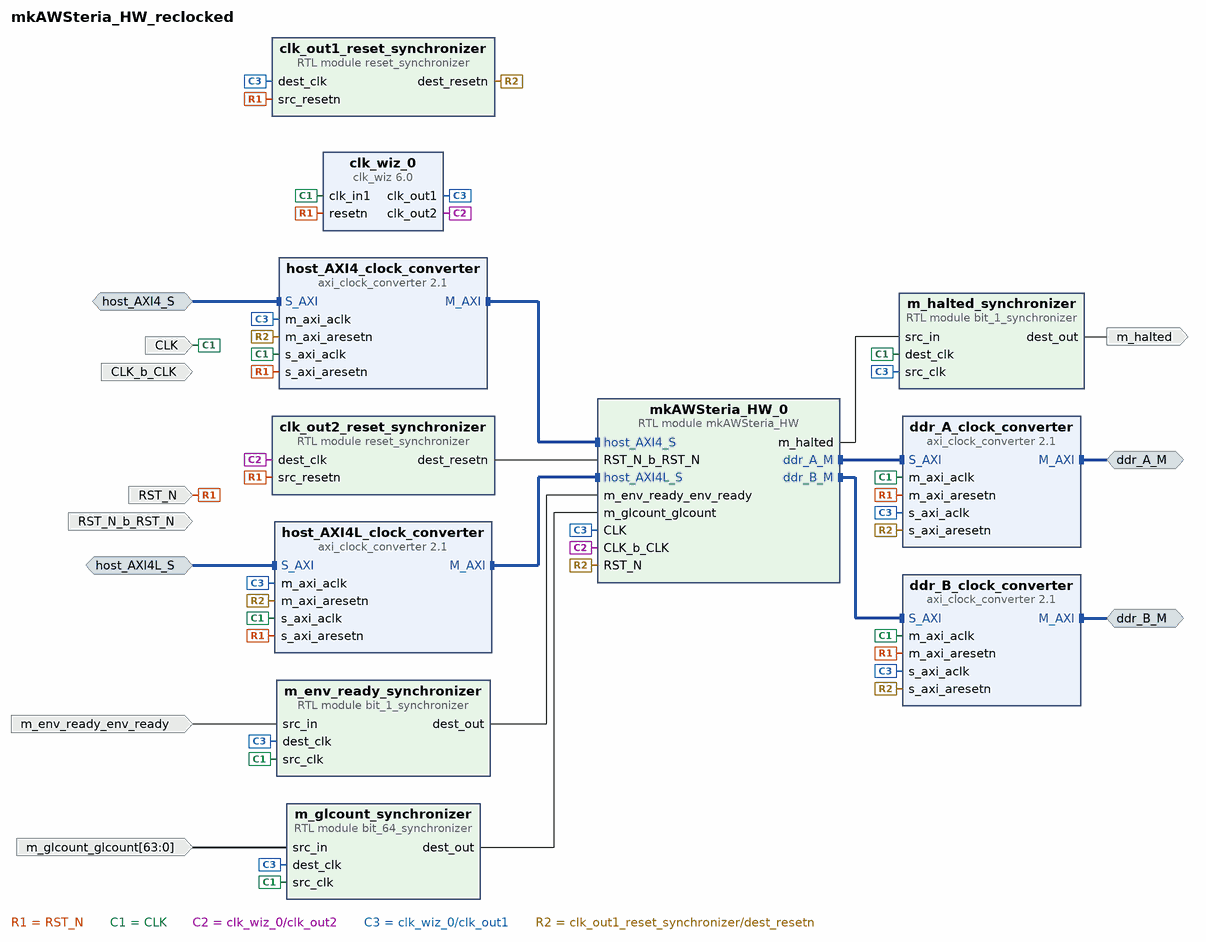
[diagram p0: block diagram of the top level]
# Vivado block design mkAWSteria_HW_reclocked, xcvu9p-flga2104-2L-e, Vivado 2019.1
create_bd_design mkAWSteria_HW_reclocked

create_bd_intf_port -mode Slave -vlnv xilinx.com:interface:aximm_rtl:1.0 host_AXI4L_S
set_property -dict [list \
  CONFIG.ADDR_WIDTH 32 \
  CONFIG.ARUSER_WIDTH 0 \
  CONFIG.AWUSER_WIDTH 0 \
  CONFIG.BUSER_WIDTH 0 \
  CONFIG.DATA_WIDTH 32 \
  CONFIG.FREQ_HZ 250000000 \
  CONFIG.HAS_BRESP 1 \
  CONFIG.HAS_BURST 0 \
  CONFIG.HAS_CACHE 0 \
  CONFIG.HAS_LOCK 0 \
  CONFIG.HAS_PROT 1 \
  CONFIG.HAS_QOS 0 \
  CONFIG.HAS_REGION 0 \
  CONFIG.HAS_RRESP 1 \
  CONFIG.HAS_WSTRB 1 \
  CONFIG.ID_WIDTH 0 \
  CONFIG.MAX_BURST_LENGTH 1 \
  CONFIG.NUM_READ_OUTSTANDING 1 \
  CONFIG.NUM_READ_THREADS 1 \
  CONFIG.NUM_WRITE_OUTSTANDING 1 \
  CONFIG.NUM_WRITE_THREADS 1 \
  CONFIG.PROTOCOL AXI4LITE \
  CONFIG.READ_WRITE_MODE READ_WRITE \
  CONFIG.RUSER_BITS_PER_BYTE 0 \
  CONFIG.RUSER_WIDTH 0 \
  CONFIG.SUPPORTS_NARROW_BURST 0 \
  CONFIG.WUSER_BITS_PER_BYTE 0 \
  CONFIG.WUSER_WIDTH 0 \
] [get_bd_intf_ports host_AXI4L_S]
create_bd_intf_port -mode Slave -vlnv xilinx.com:interface:aximm_rtl:1.0 host_AXI4_S
set_property -dict [list \
  CONFIG.ADDR_WIDTH 64 \
  CONFIG.ARUSER_WIDTH 0 \
  CONFIG.AWUSER_WIDTH 0 \
  CONFIG.BUSER_WIDTH 0 \
  CONFIG.DATA_WIDTH 512 \
  CONFIG.FREQ_HZ 250000000 \
  CONFIG.HAS_BRESP 1 \
  CONFIG.HAS_BURST 1 \
  CONFIG.HAS_CACHE 1 \
  CONFIG.HAS_LOCK 1 \
  CONFIG.HAS_PROT 1 \
  CONFIG.HAS_QOS 1 \
  CONFIG.HAS_REGION 1 \
  CONFIG.HAS_RRESP 1 \
  CONFIG.HAS_WSTRB 1 \
  CONFIG.ID_WIDTH 16 \
  CONFIG.MAX_BURST_LENGTH 256 \
  CONFIG.NUM_READ_OUTSTANDING 2 \
  CONFIG.NUM_READ_THREADS 1 \
  CONFIG.NUM_WRITE_OUTSTANDING 2 \
  CONFIG.NUM_WRITE_THREADS 1 \
  CONFIG.PROTOCOL AXI4 \
  CONFIG.READ_WRITE_MODE READ_WRITE \
  CONFIG.RUSER_BITS_PER_BYTE 0 \
  CONFIG.RUSER_WIDTH 0 \
  CONFIG.SUPPORTS_NARROW_BURST 1 \
  CONFIG.WUSER_BITS_PER_BYTE 0 \
  CONFIG.WUSER_WIDTH 0 \
] [get_bd_intf_ports host_AXI4_S]
create_bd_intf_port -mode Master -vlnv xilinx.com:interface:aximm_rtl:1.0 ddr_A_M
set_property -dict [list \
  CONFIG.ADDR_WIDTH 64 \
  CONFIG.DATA_WIDTH 512 \
  CONFIG.FREQ_HZ 250000000 \
  CONFIG.NUM_READ_OUTSTANDING 2 \
  CONFIG.NUM_WRITE_OUTSTANDING 2 \
  CONFIG.PROTOCOL AXI4 \
] [get_bd_intf_ports ddr_A_M]
create_bd_intf_port -mode Master -vlnv xilinx.com:interface:aximm_rtl:1.0 ddr_B_M
set_property -dict [list \
  CONFIG.ADDR_WIDTH 64 \
  CONFIG.DATA_WIDTH 512 \
  CONFIG.FREQ_HZ 250000000 \
  CONFIG.NUM_READ_OUTSTANDING 2 \
  CONFIG.NUM_WRITE_OUTSTANDING 2 \
  CONFIG.PROTOCOL AXI4 \
] [get_bd_intf_ports ddr_B_M]
create_bd_port -dir I -type rst RST_N
create_bd_port -dir I -type clk CLK
set_property -dict {CONFIG.FREQ_HZ 250000000} [get_bd_ports CLK]
create_bd_port -dir I m_env_ready_env_ready
create_bd_port -dir O m_halted
create_bd_port -dir I -from 63 -to 0 m_glcount_glcount
create_bd_port -dir I -type clk CLK_b_CLK
set_property -dict {CONFIG.FREQ_HZ 250000000} [get_bd_ports CLK_b_CLK]
create_bd_port -dir I -type rst RST_N_b_RST_N

create_bd_cell -type module -reference mkAWSteria_HW mkAWSteria_HW_0
create_bd_cell -type ip -vlnv xilinx.com:ip:axi_clock_converter:2.1 host_AXI4L_clock_converter
set_property -dict {CONFIG.PROTOCOL AXI4LITE} [get_bd_cells host_AXI4L_clock_converter]
create_bd_cell -type ip -vlnv xilinx.com:ip:axi_clock_converter:2.1 host_AXI4_clock_converter
set_property -dict {CONFIG.ADDR_WIDTH 64 CONFIG.DATA_WIDTH 512 CONFIG.ID_WIDTH 16} [get_bd_cells host_AXI4_clock_converter]
create_bd_cell -type ip -vlnv xilinx.com:ip:axi_clock_converter:2.1 ddr_A_clock_converter
set_property -dict {CONFIG.ADDR_WIDTH 64 CONFIG.DATA_WIDTH 512 CONFIG.ID_WIDTH 16} [get_bd_cells ddr_A_clock_converter]
create_bd_cell -type ip -vlnv xilinx.com:ip:axi_clock_converter:2.1 ddr_B_clock_converter
set_property -dict {CONFIG.ADDR_WIDTH 64 CONFIG.DATA_WIDTH 512 CONFIG.ID_WIDTH 16} [get_bd_cells ddr_B_clock_converter]
create_bd_cell -type ip -vlnv xilinx.com:ip:clk_wiz:6.0 clk_wiz_0
set_property -dict [list \
  CONFIG.CLKIN1_JITTER_PS 40.0 \
  CONFIG.CLKOUT1_JITTER 176.064 \
  CONFIG.CLKOUT1_PHASE_ERROR 154.678 \
  CONFIG.CLKOUT1_REQUESTED_OUT_FREQ 25.000 \
  CONFIG.CLKOUT2_JITTER 213.887 \
  CONFIG.CLKOUT2_PHASE_ERROR 154.678 \
  CONFIG.CLKOUT2_REQUESTED_OUT_FREQ 10.000 \
  CONFIG.CLKOUT2_USED true \
  CONFIG.MMCM_CLKFBOUT_MULT_F 24.000 \
  CONFIG.MMCM_CLKIN1_PERIOD 4.000 \
  CONFIG.MMCM_CLKIN2_PERIOD 10.0 \
  CONFIG.MMCM_CLKOUT0_DIVIDE_F 48.000 \
  CONFIG.MMCM_CLKOUT1_DIVIDE 120 \
  CONFIG.MMCM_DIVCLK_DIVIDE 5 \
  CONFIG.NUM_OUT_CLKS 2 \
  CONFIG.PRIM_IN_FREQ 250.000 \
  CONFIG.RESET_PORT resetn \
  CONFIG.RESET_TYPE ACTIVE_LOW \
  CONFIG.USE_LOCKED false \
] [get_bd_cells clk_wiz_0]
create_bd_cell -type module -reference reset_synchronizer clk_out1_reset_synchronizer
create_bd_cell -type module -reference reset_synchronizer clk_out2_reset_synchronizer
create_bd_cell -type module -reference bit_1_synchronizer m_env_ready_synchronizer
create_bd_cell -type module -reference bit_1_synchronizer m_halted_synchronizer
create_bd_cell -type module -reference bit_64_synchronizer m_glcount_synchronizer

# ---- connections ----

connect_bd_intf_net [get_bd_intf_pins ddr_A_clock_converter/S_AXI] [get_bd_intf_pins mkAWSteria_HW_0/ddr_A_M]
connect_bd_intf_net -intf_net S_AXI_0_2 [get_bd_intf_ports host_AXI4_S] [get_bd_intf_pins host_AXI4_clock_converter/S_AXI]
connect_bd_intf_net [get_bd_intf_pins host_AXI4L_clock_converter/M_AXI] [get_bd_intf_pins mkAWSteria_HW_0/host_AXI4L_S]
connect_bd_intf_net -intf_net S_AXI_0_1 [get_bd_intf_ports host_AXI4L_S] [get_bd_intf_pins host_AXI4L_clock_converter/S_AXI]
connect_bd_intf_net [get_bd_intf_ports ddr_A_M] [get_bd_intf_pins ddr_A_clock_converter/M_AXI]
connect_bd_intf_net [get_bd_intf_pins ddr_B_clock_converter/S_AXI] [get_bd_intf_pins mkAWSteria_HW_0/ddr_B_M]
connect_bd_intf_net [get_bd_intf_pins host_AXI4_clock_converter/M_AXI] [get_bd_intf_pins mkAWSteria_HW_0/host_AXI4_S]
connect_bd_intf_net [get_bd_intf_ports ddr_B_M] [get_bd_intf_pins ddr_B_clock_converter/M_AXI]
connect_bd_net -net resetn_0_1 [get_bd_ports RST_N] \
  [get_bd_pins clk_wiz_0/resetn] [get_bd_pins clk_out1_reset_synchronizer/src_resetn] \
  [get_bd_pins clk_out2_reset_synchronizer/src_resetn] [get_bd_pins host_AXI4_clock_converter/s_axi_aresetn] \
  [get_bd_pins host_AXI4L_clock_converter/s_axi_aresetn] [get_bd_pins ddr_A_clock_converter/m_axi_aresetn] \
  [get_bd_pins ddr_B_clock_converter/m_axi_aresetn]
connect_bd_net -net clk_in1_0_1 [get_bd_ports CLK] \
  [get_bd_pins clk_wiz_0/clk_in1] [get_bd_pins host_AXI4L_clock_converter/s_axi_aclk] \
  [get_bd_pins host_AXI4_clock_converter/s_axi_aclk] [get_bd_pins ddr_A_clock_converter/m_axi_aclk] \
  [get_bd_pins ddr_B_clock_converter/m_axi_aclk] [get_bd_pins m_env_ready_synchronizer/src_clk] \
  [get_bd_pins m_halted_synchronizer/dest_clk] [get_bd_pins m_glcount_synchronizer/src_clk]
connect_bd_net [get_bd_pins clk_wiz_0/clk_out2] [get_bd_pins clk_out2_reset_synchronizer/dest_clk] [get_bd_pins mkAWSteria_HW_0/CLK_b_CLK]
connect_bd_net [get_bd_pins clk_wiz_0/clk_out1] \
  [get_bd_pins clk_out1_reset_synchronizer/dest_clk] [get_bd_pins m_env_ready_synchronizer/dest_clk] \
  [get_bd_pins m_halted_synchronizer/src_clk] [get_bd_pins m_glcount_synchronizer/dest_clk] \
  [get_bd_pins host_AXI4L_clock_converter/m_axi_aclk] [get_bd_pins host_AXI4_clock_converter/m_axi_aclk] \
  [get_bd_pins ddr_A_clock_converter/s_axi_aclk] [get_bd_pins ddr_B_clock_converter/s_axi_aclk] \
  [get_bd_pins mkAWSteria_HW_0/CLK]
connect_bd_net [get_bd_pins m_env_ready_synchronizer/dest_out] [get_bd_pins mkAWSteria_HW_0/m_env_ready_env_ready]
connect_bd_net -net src_in_0_1 [get_bd_ports m_env_ready_env_ready] [get_bd_pins m_env_ready_synchronizer/src_in]
connect_bd_net [get_bd_pins mkAWSteria_HW_0/m_halted] [get_bd_pins m_halted_synchronizer/src_in]
connect_bd_net [get_bd_pins m_halted_synchronizer/dest_out] [get_bd_ports m_halted]
connect_bd_net [get_bd_pins m_glcount_synchronizer/dest_out] [get_bd_pins mkAWSteria_HW_0/m_glcount_glcount]
connect_bd_net -net src_in_0_2 [get_bd_ports m_glcount_glcount] [get_bd_pins m_glcount_synchronizer/src_in]
connect_bd_net [get_bd_pins clk_out2_reset_synchronizer/dest_resetn] [get_bd_pins mkAWSteria_HW_0/RST_N_b_RST_N]
connect_bd_net [get_bd_pins clk_out1_reset_synchronizer/dest_resetn] \
  [get_bd_pins mkAWSteria_HW_0/RST_N] [get_bd_pins host_AXI4_clock_converter/m_axi_aresetn] \
  [get_bd_pins host_AXI4L_clock_converter/m_axi_aresetn] [get_bd_pins ddr_B_clock_converter/s_axi_aresetn] \
  [get_bd_pins ddr_A_clock_converter/s_axi_aresetn]

# ---- address map ----
exclude_bd_addr_seg -offset 0x0000000000000000 -range 16E -target_address_space [get_bd_addr_spaces host_AXI4_S] [get_bd_addr_segs mkAWSteria_HW_0/host_AXI4_S/reg0]
exclude_bd_addr_seg -offset 0x00000000 -range 4G -target_address_space [get_bd_addr_spaces host_AXI4L_S] [get_bd_addr_segs mkAWSteria_HW_0/host_AXI4L_S/reg0]
exclude_bd_addr_seg -offset 0x0000000044A00000 -range 64K -target_address_space [get_bd_addr_spaces mkAWSteria_HW_0/ddr_A_M] [get_bd_addr_segs ddr_A_M/Reg]
exclude_bd_addr_seg -offset 0x0000000044A00000 -range 64K -target_address_space [get_bd_addr_spaces mkAWSteria_HW_0/ddr_B_M] [get_bd_addr_segs ddr_B_M/Reg]

validate_bd_design
save_bd_design
